# Altium project DAC_40MHz.PrjPCB
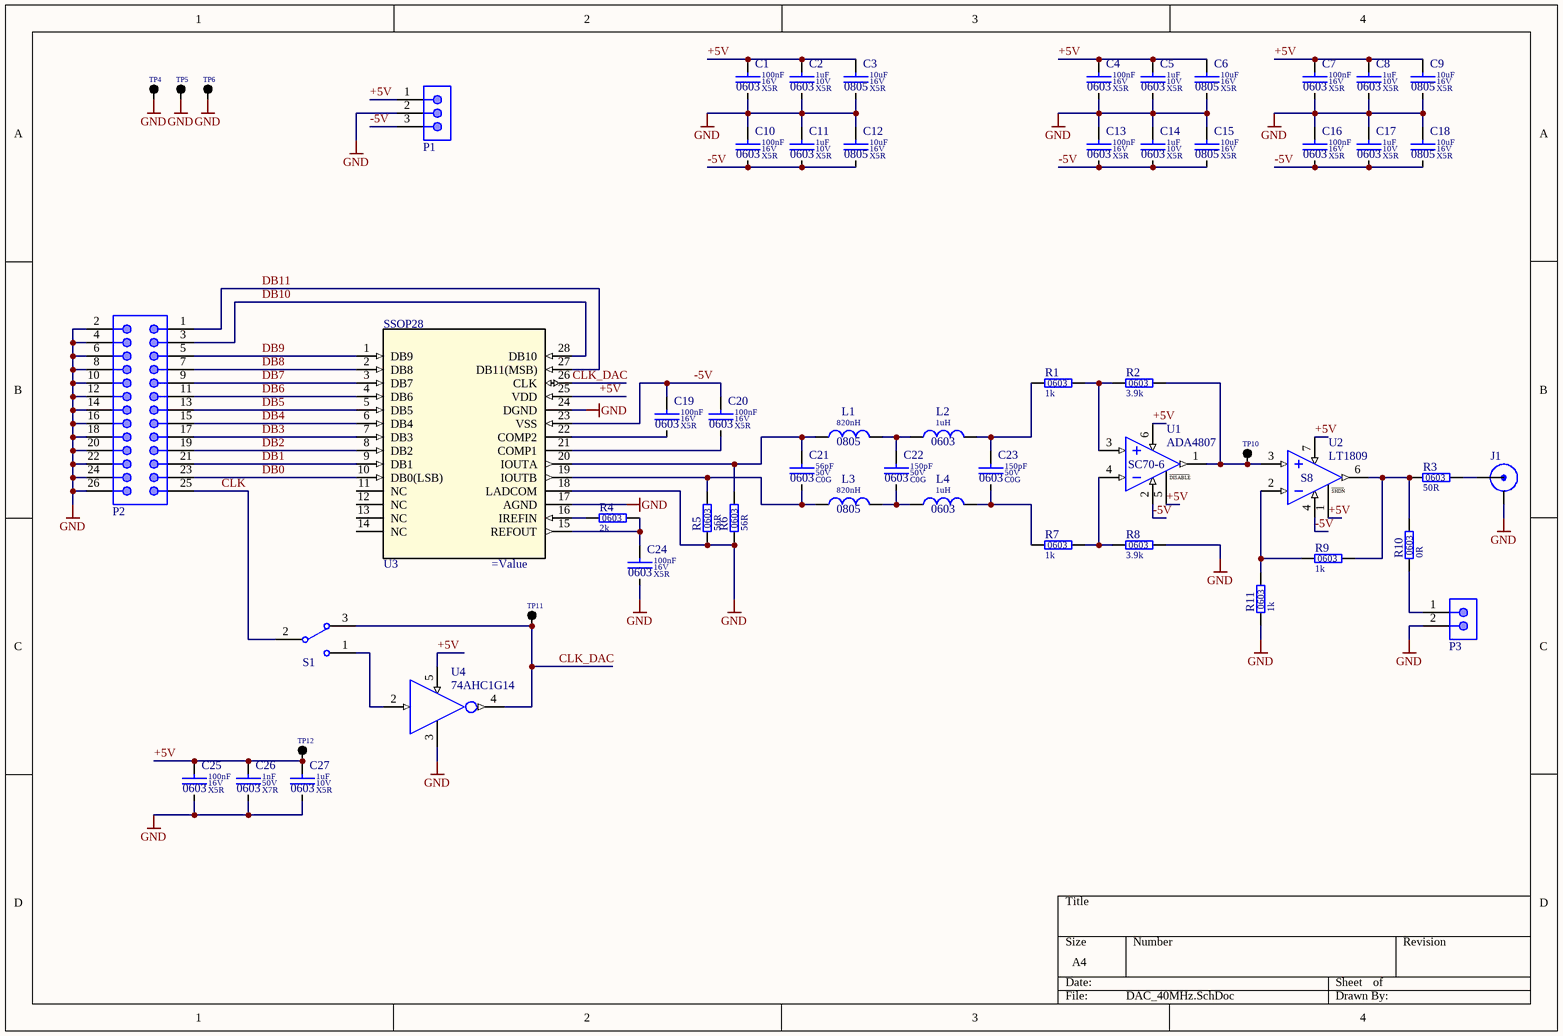
[diagram p0: DAC_40MHz.SchDoc]
1 sheet, 57 parts. Net scope: global (net labels, ports and power ports of the same name join across sheets).
Board file: DAC_40MHz.PcbDoc

## Sheet DAC_40MHz.SchDoc
size A4

### Parts
C1  value 100nF  Dielectric: X5R  Voltage: 16V  SCH_Footprint: 0603  [C_0603]  (hidden comment: Ceramic X5R)
C2  value 1uF  Dielectric: X5R  Voltage: 10V  SCH_Footprint: 0603  [C_0603]  (hidden comment: Ceramic X5R)
C3  value 10uF  Dielectric: X5R  Voltage: 16V  SCH_Footprint: 0805  [C_0805]  (hidden comment: Ceramic X5R)
C4  value 100nF  Dielectric: X5R  Voltage: 16V  SCH_Footprint: 0603  [C_0603]  (hidden comment: Ceramic X5R)
C5  value 1uF  Dielectric: X5R  Voltage: 10V  SCH_Footprint: 0603  [C_0603]  (hidden comment: Ceramic X5R)
C6  value 10uF  Dielectric: X5R  Voltage: 16V  SCH_Footprint: 0805  [C_0805]  (hidden comment: Ceramic X5R)
C7  value 100nF  Dielectric: X5R  Voltage: 16V  SCH_Footprint: 0603  [C_0603]  (hidden comment: Ceramic X5R)
C8  value 1uF  Dielectric: X5R  Voltage: 10V  SCH_Footprint: 0603  [C_0603]  (hidden comment: Ceramic X5R)
C9  value 10uF  Dielectric: X5R  Voltage: 16V  SCH_Footprint: 0805  [C_0805]  (hidden comment: Ceramic X5R)
C10  value 100nF  Dielectric: X5R  Voltage: 16V  SCH_Footprint: 0603  [C_0603]  (hidden comment: Ceramic X5R)
C11  value 1uF  Dielectric: X5R  Voltage: 10V  SCH_Footprint: 0603  [C_0603]  (hidden comment: Ceramic X5R)
C12  value 10uF  Dielectric: X5R  Voltage: 16V  SCH_Footprint: 0805  [C_0805]  (hidden comment: Ceramic X5R)
C13  value 100nF  Dielectric: X5R  Voltage: 16V  SCH_Footprint: 0603  [C_0603]  (hidden comment: Ceramic X5R)
C14  value 1uF  Dielectric: X5R  Voltage: 10V  SCH_Footprint: 0603  [C_0603]  (hidden comment: Ceramic X5R)
C15  value 10uF  Dielectric: X5R  Voltage: 16V  SCH_Footprint: 0805  [C_0805]  (hidden comment: Ceramic X5R)
C16  value 100nF  Dielectric: X5R  Voltage: 16V  SCH_Footprint: 0603  [C_0603]  (hidden comment: Ceramic X5R)
C17  value 1uF  Dielectric: X5R  Voltage: 10V  SCH_Footprint: 0603  [C_0603]  (hidden comment: Ceramic X5R)
C18  value 10uF  Dielectric: X5R  Voltage: 16V  SCH_Footprint: 0805  [C_0805]  (hidden comment: Ceramic X5R)
C19  value 100nF  Dielectric: X5R  Voltage: 16V  SCH_Footprint: 0603  [C_0603]  (hidden comment: Ceramic X5R)
C20  value 100nF  Dielectric: X5R  Voltage: 16V  SCH_Footprint: 0603  [C_0603]  (hidden comment: Ceramic X5R)
C21  value 56pF  Dielectric: C0G  Voltage: 50V  SCH_Footprint: 0603  [C_0603]  (hidden comment: Ceramic C0G)
C22  value 150pF  Dielectric: C0G  Voltage: 50V  SCH_Footprint: 0603  [C_0603]  (hidden comment: Ceramic C0G)
C23  value 150pF  Dielectric: C0G  Voltage: 50V  SCH_Footprint: 0603  [C_0603]  (hidden comment: Ceramic C0G)
C24  value 100nF  Dielectric: X5R  Voltage: 16V  SCH_Footprint: 0603  [C_0603]  (hidden comment: Ceramic X5R)
C25  value 100nF  Dielectric: X5R  Voltage: 16V  SCH_Footprint: 0603  [C_0603]  (hidden comment: Ceramic X5R)
C26  value 1nF  Dielectric: X7R  Voltage: 50V  SCH_Footprint: 0603  [C_0603]  (hidden comment: Ceramic X7R)
C27  value 1uF  Dielectric: X5R  Voltage: 10V  SCH_Footprint: 0603  [C_0603]  (hidden comment: Ceramic X5R)
J1  SMA vertical connector  [J_SMA_VERTICAL]  (value not drawn)
L1  value 820nH  SCH_Footprint: 0805  [L_0805]  (hidden comment: Inductor)
L2  value 1uH  SCH_Footprint: 0603  [L_0603]  (hidden comment: Inductor)
L3  value 820nH  SCH_Footprint: 0805  [L_0805]  (hidden comment: Inductor)
L4  value 1uH  SCH_Footprint: 0603  [L_0603]  (hidden comment: Inductor)
P1  Header 1x3, THT, 2,54mm  [P_HEADER_1x3_THT_2.54_VERT]  (value not drawn)
P2  Header 2x13, THT, 2,54mm  [P_HEADER_2x13_THT_2.54_VERT]  (value not drawn)
P3  Header 1x2, THT, 2,54mm  [P_HEADER_1x2_THT_2.54_VERT]  (value not drawn)
R1  value 1k  SCH_Footprint: 0603  [R_0603]  (hidden comment: Resistor)
R2  value 3.9k  SCH_Footprint: 0603  [R_0603]  (hidden comment: Resistor)
R3  value 50R  SCH_Footprint: 0603  [R_0603]  (hidden comment: Resistor)
R4  value 2k  SCH_Footprint: 0603  [R_0603]  (hidden comment: Resistor)
R5  value 56R  SCH_Footprint: 0603  [R_0603]  (hidden comment: Resistor)
R6  value 56R  SCH_Footprint: 0603  [R_0603]  (hidden comment: Resistor)
R7  value 1k  SCH_Footprint: 0603  [R_0603]  (hidden comment: Resistor)
R8  value 3.9k  SCH_Footprint: 0603  [R_0603]  (hidden comment: Resistor)
R9  value 1k  SCH_Footprint: 0603  [R_0603]  (hidden comment: Resistor)
R10  value 0R  SCH_Footprint: 0603  [R_0603]  (hidden comment: Resistor)
R11  value 1k  SCH_Footprint: 0603  [R_0603]  (hidden comment: Resistor)
S1  Single Pole Double Throw Slideswitch  [S_SLIDESWITCH_SPDT]  (value not drawn)
TP4  Single pin  [TP_1PIN]  (value not drawn)
TP5  Single pin  [TP_1PIN]  (value not drawn)
TP6  Single pin  [TP_1PIN]  (value not drawn)
TP10  Single pin  [TP_1PIN]  (value not drawn)
TP11  Single pin  [TP_1PIN]  (value not drawn)
TP12  Single pin  [TP_1PIN]  (value not drawn)
U1  ADA4807  SCH_Footprint: SC70-6  [SC70-6_TSSOP6_2X1.25_MD]
U2  LT1809  SCH_Footprint: S8  [S8_SOP8_SOIC8_SO8_4.9X3.9_MD]
U3  SCH_Footprint: SSOP28  [SSOP28_SOP28_SO28_SOIC8_10.2X5.29_MD]
U4  74AHC1G14  [SOT23-5_2.05X2.13_MD]

### Nets
GND: C1.2 C2.2 C3.2 C4.2 C5.2 C6.2 C7.2 C8.2 C9.2 C10.1 C11.1 C12.1 C13.1 C14.1 C15.1 C16.1 C17.1 C18.1 C24.2 C25.2 C26.2 C27.2 J1.2(GND) P1.2 P2.2 P2.4 P2.6 P2.8 P2.10 P2.12 P2.14 P2.16 P2.18 P2.20 P2.22 P2.24 P2.26 P3.2 R5.1 R6.1 R8.2 R11.1 TP4.1(TP) TP5.1(TP) TP6.1(TP) U3.17(AGND) U3.18(LADCOM) U3.24(DGND) U4.3(GND)
+5V: C1.1 C2.1 C3.1 C4.1 C5.1 C6.1 C7.1 C8.1 C9.1 C25.1 C26.1 C27.1 P1.1 TP12.1(TP) U1.5(~{DISABL}E) U1.6(Vs+) U2.1(~{SHD}N) U2.7(Vs+) U3.25(VDD) U4.5(Vcc)
-5V: C10.2 C11.2 C12.2 C13.2 C14.2 C15.2 C16.2 C17.2 C18.2 C19.1 C20.1 P1.3 U1.2(Vs-) U2.4(Vs-) U3.23(VSS)
CLK: P2.25 S1.2
CLK_DAC: S1.3 TP11.1(TP) U3.26(CLK) U4.4(OUT)
DB0: P2.23 U3.10(DB0(LSB))
DB1: P2.21 U3.9(DB1)
DB2: P2.19 U3.8(DB2)
DB3: P2.17 U3.7(DB3)
DB4: P2.15 U3.6(DB4)
DB5: P2.13 U3.5(DB5)
DB6: P2.11 U3.4(DB6)
DB7: P2.9 U3.3(DB7)
DB8: P2.7 U3.2(DB8)
DB9: P2.5 U3.1(DB9)
DB10: P2.3 U3.28(DB10)
DB11: P2.1 U3.27(DB11(MSB))
NetC19_2: C19.2 U3.22(COMP2)
NetC20_2: C20.2 U3.21(COMP1)
NetC21_1: C21.1 L1.1 R6.2 U3.20(IOUTA)
NetC21_2: C21.2 L3.1 R5.2 U3.19(IOUTB)
NetC22_1: C22.1 L1.2 L2.1
NetC22_2: C22.2 L3.2 L4.1
NetC23_1: C23.1 L2.2 R1.1
NetC23_2: C23.2 L4.2 R7.1
NetC24_1: C24.1 R4.2 U3.15(REFOUT)
NetJ1_1: J1.1(SIGNAL) R3.2
NetP3_1: P3.1 R10.1
NetR1_2: R1.2 R2.1 U1.3(IN+)
NetR2_2: R2.2 TP10.1(TP) U1.1(OUT) U2.3(IN+)
NetR3_1: R3.1 R9.2 R10.2 U2.6(OUT)
NetR4_1: R4.1 U3.16(IREFIN)
NetR7_2: R7.2 R8.1 U1.4(IN-)
NetR9_1: R9.1 R11.2 U2.2(IN-)
NetS1_1: S1.1 U4.2(A)

Not connected (* = marked no-connect by the designer): U3 11(NC) 12(NC) 13(NC) 14(NC)

### Notes on the sheet
- (in symbol U_ADA4807-1AKSZ-R2) ________ / DISABLE
- (in symbol U_LT1809CS8) _____ / SHDN

### Library data of the parts
C1 C4 C7 C10 C13 C16 C19 C20 C24 C25 = C_100nF_16V_X5R_0603_10: Capacitor; Manufacturer: KEMET; Manufacturer part number: C0603C104K4PACTU; Tolerance: 10%; Part Number: C_100nF_16V_X5R_0603_10; HelpURL: http://www.farnell.com/datasheets/2750585.pdf?_ga=2.131384847.1622004241.1573469514-1370716462.1573297970; Supplier 1: TME; Supplier part number 1: C0603C104K4PACTU; Supplier 2: RS Components; Supplier 3: Farnell; Supplier part number 3: 2773120; Supplier 4: Mouser; Supplier part number 4: 80-C0603C104K4P; Supplier 5: Digi-Key; Supplier part number 5: 399-14941-1-ND
C2 C5 C8 C11 C14 C17 C27 = C_1uF_10V_X5R_0603_10: Capacitor; Manufacturer: KEMET; Manufacturer part number: C0603C105K8PACTU; Tolerance: 10%; Part Number: C_1uF_10V_X5R_0603_10; HelpURL: http://www.farnell.com/datasheets/2739653.pdf?_ga=2.68618001.1622004241.1573469514-1370716462.1573297970; Supplier 1: TME; Supplier 2: RS Components; Supplier 3: Farnell; Supplier part number 3: 9227776; Supplier 4: Mouser; Supplier part number 4: 80-C0603C105K8P; Supplier 5: Digi-Key; Supplier part number 5: 399-3118-1-ND
C3 C6 C9 C12 C15 C18 = C_10uF_16V_X5R_0805_10: Capacitor; Tolerance: 10%; Part Number: C_10uF_16V_X5R_0805_10; Supplier 1: TME; Supplier 2: RS Components; Supplier 3: Farnell; Supplier 4: Mouser; Supplier 5: Digi-Key
C21 = C_56pF_50V_C0G_0603_5: Capacitor; Manufacturer: MULTICOMP; Manufacturer part number: MC0603N560J500CT; Tolerance: 5%; Part Number: C_56pF_50V_C0G_0603_5; HelpURL: http://www.farnell.com/datasheets/1870456.pdf?_ga=2.79548562.723038991.1573297970-1370716462.1573297970; Supplier 1: TME; Supplier 2: RS Components; Supplier 3: Farnell; Supplier part number 3: 1759063; Supplier 4: Mouser; Supplier 5: Digi-Key
C22 C23 = C_150pF_50V_C0G_0603_5: Capacitor; Manufacturer: KEMET; Manufacturer part number: C0603C151J5GACTU; Tolerance: 5%; Part Number: C_150pF_50V_C0G_0603_5; HelpURL: http://www.farnell.com/datasheets/2740964.pdf?_ga=2.103099776.1622004241.1573469514-1370716462.1573297970; Supplier 1: TME; Supplier 2: RS Components; Supplier 3: Farnell; Supplier part number 3: 1414615; Supplier 4: Mouser; Supplier part number 4: 80-C0603C151J5G; Supplier 5: Digi-Key; Supplier part number 5: 399-1063-1-ND
C26 = C_1nF_50V_X7R_0603_10: Capacitor; Manufacturer: MULTICOMP; Manufacturer part number: MCU0603R102KCT; Tolerance: 10%; Part Number: C_1nF_50V_X7R_0603_10; HelpURL: http://www.farnell.com/datasheets/2863930.pdf?_ga=2.60809645.1622004241.1573469514-1370716462.1573297970; Supplier 1: TME; Supplier 2: RS Components; Supplier 3: Farnell; Supplier part number 3: 9406174; Supplier 4: Mouser; Supplier 5: Digi-Key
J1 = J_SMA_VERTICAL: Part Number: J_SMA_VERTICAL; SCH_Footprint: J_SMA_VERTICAL
L1 L3 = L_820nH_180mA_0805: Induction; Manufacturer: MULTICOMP; Manufacturer Part Number: MCFT000127; Current: 180mA; Resistance: 2.35R; Part Number: L_820nH_180mA_0805; HelpURL: http://www.farnell.com/datasheets/2861609.pdf?_ga=2.107285122.1622004241.1573469514-1370716462.1573297970; Supplier 1: TME; Supplier 2: RS Components; Supplier 3: Farnell; Supplier Part Number 3: 1711846; Supplier 4: Mouser; Supplier 5: Digi-Key
L2 L4 = L_1uH_100mA_0603: Induction; Manufacturer: BOURNS; Manufacturer Part Number: CS160808-1R0K; Current: 100mA; Resistance: 500mR; Part Number: L_1uH_100mA_0603; HelpURL: http://www.farnell.com/datasheets/1727952.pdf?_ga=2.136259249.1622004241.1573469514-1370716462.1573297970; Supplier 1: TME; Supplier 2: RS Components; Supplier 3: Farnell; Supplier Part Number 3: 2858948; Supplier 4: Mouser; Supplier 5: Digi-Key
P1 = P_HEADER_1x3_THT_2.54_VERT: Pin Header, THT, pitch 2.54mm, Single Row, Vertical, 3pin; Part Number: P_HEADER_1x3_THT_2.54_VERT; SCH_Footprint: P_HEADER_1x3_THT_2.54_VERT
P2 = P_HEADER_2x13_THT_2.54_VERT: Pin Header, THT, pitch 2.54mm, Dual Row, Vertical, 26pin; Part Number: P_HEADER_2x13_THT_2.54_VERT; SCH_Footprint: P_HEADER_2x13_THT_2.54_VERT
P3 = P_HEADER_1x2_THT_2.54_VERT: Pin Header, THT, pitch 2.54mm, Single Row, Vertical, 2pin; Part Number: P_HEADER_1x2_THT_2.54_VERT; SCH_Footprint: P_HEADER_1x2_THT_2.54_VERT
R1 R7 R9 R11 = R_1k_0603_1: Manufacturers: MULTICOMP; Manufacturer Part Number: MCWR06X1001FTL; Tolerance: 1%; Power: 100mW; Voltage: 50V; Part number: R_1k_0603_1; HelpURL: http://www.farnell.com/datasheets/2860681.pdf?_ga=2.62376492.1622004241.1573469514-1370716462.1573297970; Supplier 1: TME; Supplier 2: RS Components; Supplier 3: Farnell; Supplier part number 3: 2447272; Supplier 4: Mouser; Supplier 5: Digi-Key
R2 R8 = R_3.9k_0603_1: Manufacturers: MULTICOMP; Manufacturer Part Number: MCWR06X3901FTL; Tolerance: 1%; Power: 100mW; Voltage: 50V; Part number: R_3.9k_0603_1; HelpURL: http://www.farnell.com/datasheets/2860681.pdf?_ga=2.62376492.1622004241.1573469514-1370716462.1573297970; Supplier 1: TME; Supplier 2: RS Components; Supplier 3: Farnell; Supplier part number 3: 2447363; Supplier 4: Mouser; Supplier 5: Digi-Key
R3 = R_50R_0603_1: Manufacturers: VISHAY; Manufacturer Part Number: CRCW060350R0FKEA; Tolerance: 1%; Power: 100mW; Voltage: 75V; Part number: R_50R_0603_1; HelpURL: http://www.farnell.com/datasheets/2310790.pdf?_ga=2.127191693.1622004241.1573469514-1370716462.1573297970; Supplier 1: TME; Supplier 2: RS Components; Supplier 3: Farnell; Supplier part number 3: 2112878; Supplier 4: Mouser; Supplier 5: Digi-Key
R4 = R_2k_0603_1: Tolerance: 1%; Power: 100mW; Voltage: 50V; Part number: R_2k_0603_1; Supplier 1: TME; Supplier 2: RS Components; Supplier 3: Farnell; Supplier 4: Mouser; Supplier 5: Digi-Key
R5 R6 = R_56R_0603_1: Manufacturers: MULTICOMP; Manufacturer Part Number: MCWF06P56R0FTL; Tolerance: 1%; Power: 100mW; Voltage: 50V; Part number: R_56R_0603_1; HelpURL: http://www.farnell.com/datasheets/2864032.pdf?_ga=2.132541966.1622004241.1573469514-1370716462.1573297970; Supplier 1: TME; Supplier 2: RS Components; Supplier 3: Farnell; Supplier part number 3: 2694086; Supplier 4: Mouser; Supplier 5: Digi-Key
R10 = R_0R_0603_1: Tolerance: 1%; Power: 100mW; Voltage: 50V; Part number: R_0R_0603_1; Supplier 1: TME; Supplier 2: RS Components; Supplier 3: Farnell; Supplier 4: Mouser; Supplier 5: Digi-Key
S1 = S_SLIDESWITCH_SPDT_OS102011MS2QN1: Value: OS102011MS2QN13; Part Number: S_SLIDESWITCH_SPDT_OS102011MS2QN1; SCH_Footprint: S_SPDT; HelpURL: https://pl.mouser.com/datasheet/2/60/os-1382783.pdf; Manufacturer Part Number: OS102011MS2QN13; Supplier 1: TME; Supplier 2: RS Components; Supplier 3: Farnell; Supplier 4: Mouser; Supplier 5: Digi-Key
TP4-TP6 TP10-TP12 = TP_1PIN: Testpoint; SCH_Footprint: Single; Part Number: TP_1PIN; Component Type: Standard; Supplier 1: TME; Supplier 2: RS Components; Supplier 3: Farnell; Supplier 4: Mouser; Supplier 5: Digi-Key
U1 = U_ADA4807-1AKSZ-R2: Manufacturer: ANALOG DEVICES; Part Number: U_ADA4807-1AKSZ-R2; Value: ADA4807; HelpURL: https://www.analog.com/media/en/technical-documentation/data-sheets/ADA4807-1_4807-2_4807-4.pdf; Manufacturer Part Number: ADA4807; Supplier 1: TME; Supplier 2: RS Components; Supplier 3: Farnell; Supplier 4: Mouser; Supplier 5: Digi-Key
U2 = U_LT1809CS8: Manufacturer: ANALOG DEVICES; Part Number: U_LT1809CS8; Value: LT1809; HelpURL: https://www.analog.com/media/en/technical-documentation/data-sheets/180910fa.pdf; Manufacturer Part Number: LT1809; Supplier 1: TME; Supplier 2: RS Components; Supplier 3: Farnell; Supplier 4: Mouser; Supplier 5: Digi-Key
U3 = U_LTC1666: 12-bit 50Msps DAC; Manufacturer: ANALOG DEVICES; Part Number: U_LTC1666; Value: LTC1666; HelpURL: https://www.analog.com/media/en/technical-documentation/data-sheets/166678f.pdf; Manufacturer Part Number: LTC1666
U4 = U_74AHC1G14: Inverting Schmitt trigger; Manufacturer: NEXPERIA; SCH_Footprint: TSSOP5; Part Number: U_74AHC1G14; Value: 74AHC1G14; HelpURL: http://www.farnell.com/datasheets/2014360.pdf?_ga=2.152704443.389134298.1573586833-761150148.1573586833; Manufacturer Part Number: 74AHC1G14